# Altium schematic sheet LTDC.SchDoc
size A4
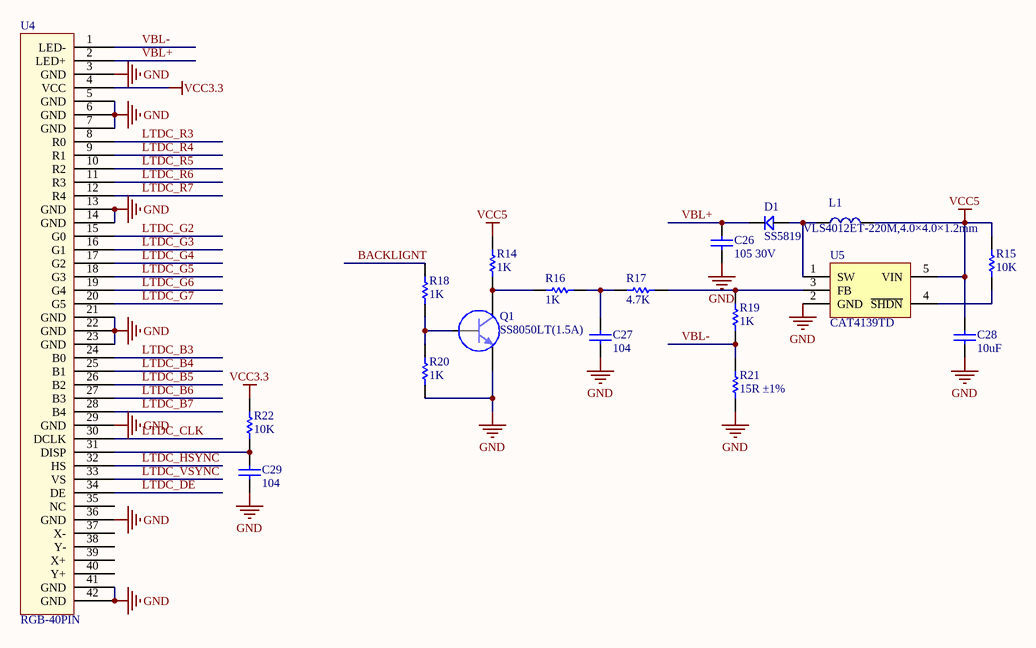
[diagram p0: LTDC.SchDoc]

## Parts
C26  105 30V  [0603C]
C27  104  [0603C]
C28  10uF  [0603C]
C29  104  [0603C]
D1  SS5819  [SMA]
L1  VLS4012ET-220M,4.0×4.0×1.2mm  [0603P]
Q1  SS8050LT(1.5A)
R14  1K  [0603R]
R15  10K  [0603R]
R16  1K  [0603R]
R17  4.7K  [0603R]
R18  1K  [0603R]
R19  1K  [0603R]
R20  1K  [0603R]
R21  15R ±1%  [0603R]
R22  10K  [0603R]
U4  RGB-40PIN  [FPC40P_0.5MM]
U5  CAT4139TD

## Nets
GND: C26.1 C27.1 C28.1 C29.1 Q1.2(E) R20.1 R21.1 U4.3(GND) U4.5(GND) U4.6(GND) U4.7(GND) U4.13(GND) U4.14(GND) U4.21(GND) U4.22(GND) U4.23(GND) U4.29(GND) U4.36(GND) U4.41(GND) U4.42(GND) U5.2(GND)
VCC3.3: R22.2 U4.4(VCC)
VCC5: C28.2 L1.2 R14.2 R15.2 U5.5(VIN)
BACKLIGNT: R18.2
LTDC_B3: U4.24(B0)
LTDC_B4: U4.25(B1)
LTDC_B5: U4.26(B2)
LTDC_B6: U4.27(B3)
LTDC_B7: U4.28(B4)
LTDC_CLK: U4.30(DCLK)
LTDC_DE: U4.34(DE)
LTDC_G2: U4.15(G0)
LTDC_G3: U4.16(G1)
LTDC_G4: U4.17(G2)
LTDC_G5: U4.18(G3)
LTDC_G6: U4.19(G4)
LTDC_G7: U4.20(G5)
LTDC_HSYNC: U4.32(HS)
LTDC_R3: U4.8(R0)
LTDC_R4: U4.9(R1)
LTDC_R5: U4.10(R2)
LTDC_R6: U4.11(R3)
LTDC_R7: U4.12(R4)
LTDC_VSYNC: U4.33(VS)
VBL+: C26.2 D1.2 U4.2(LED+)
VBL-: R19.1 R21.2 U4.1(LED-)
NetC27_2: C27.2 R16.1 R17.1
NetC29_2: C29.2 R22.1 U4.31(DISP)
NetD1_1: D1.1 L1.1 U5.1(SW)
NetQ1_1: Q1.1(B) R18.1 R20.2
NetQ1_3: Q1.3(C) R14.1 R16.2
NetR15_1: R15.1 U5.4(~{SHDN})
NetR17_2: R17.2 R19.2 U5.3(FB)

Not connected (* = marked no-connect by the designer): U4 35(NC) 37(X-) 38(Y-) 39(X+) 40(Y+)

## Library data of the parts
C26-C29 = CAP-0603: 电容
D1 = 1N4007
L1 = L
Q1 = S8050-R
R14-R22 = RES-0603: Resistance
U4 = RGB-40PIN: 40P通用液晶屏接口
U5 = CAT4139TD: 背光芯片